# EAGLE design Board (EAGLE 7.3.0)
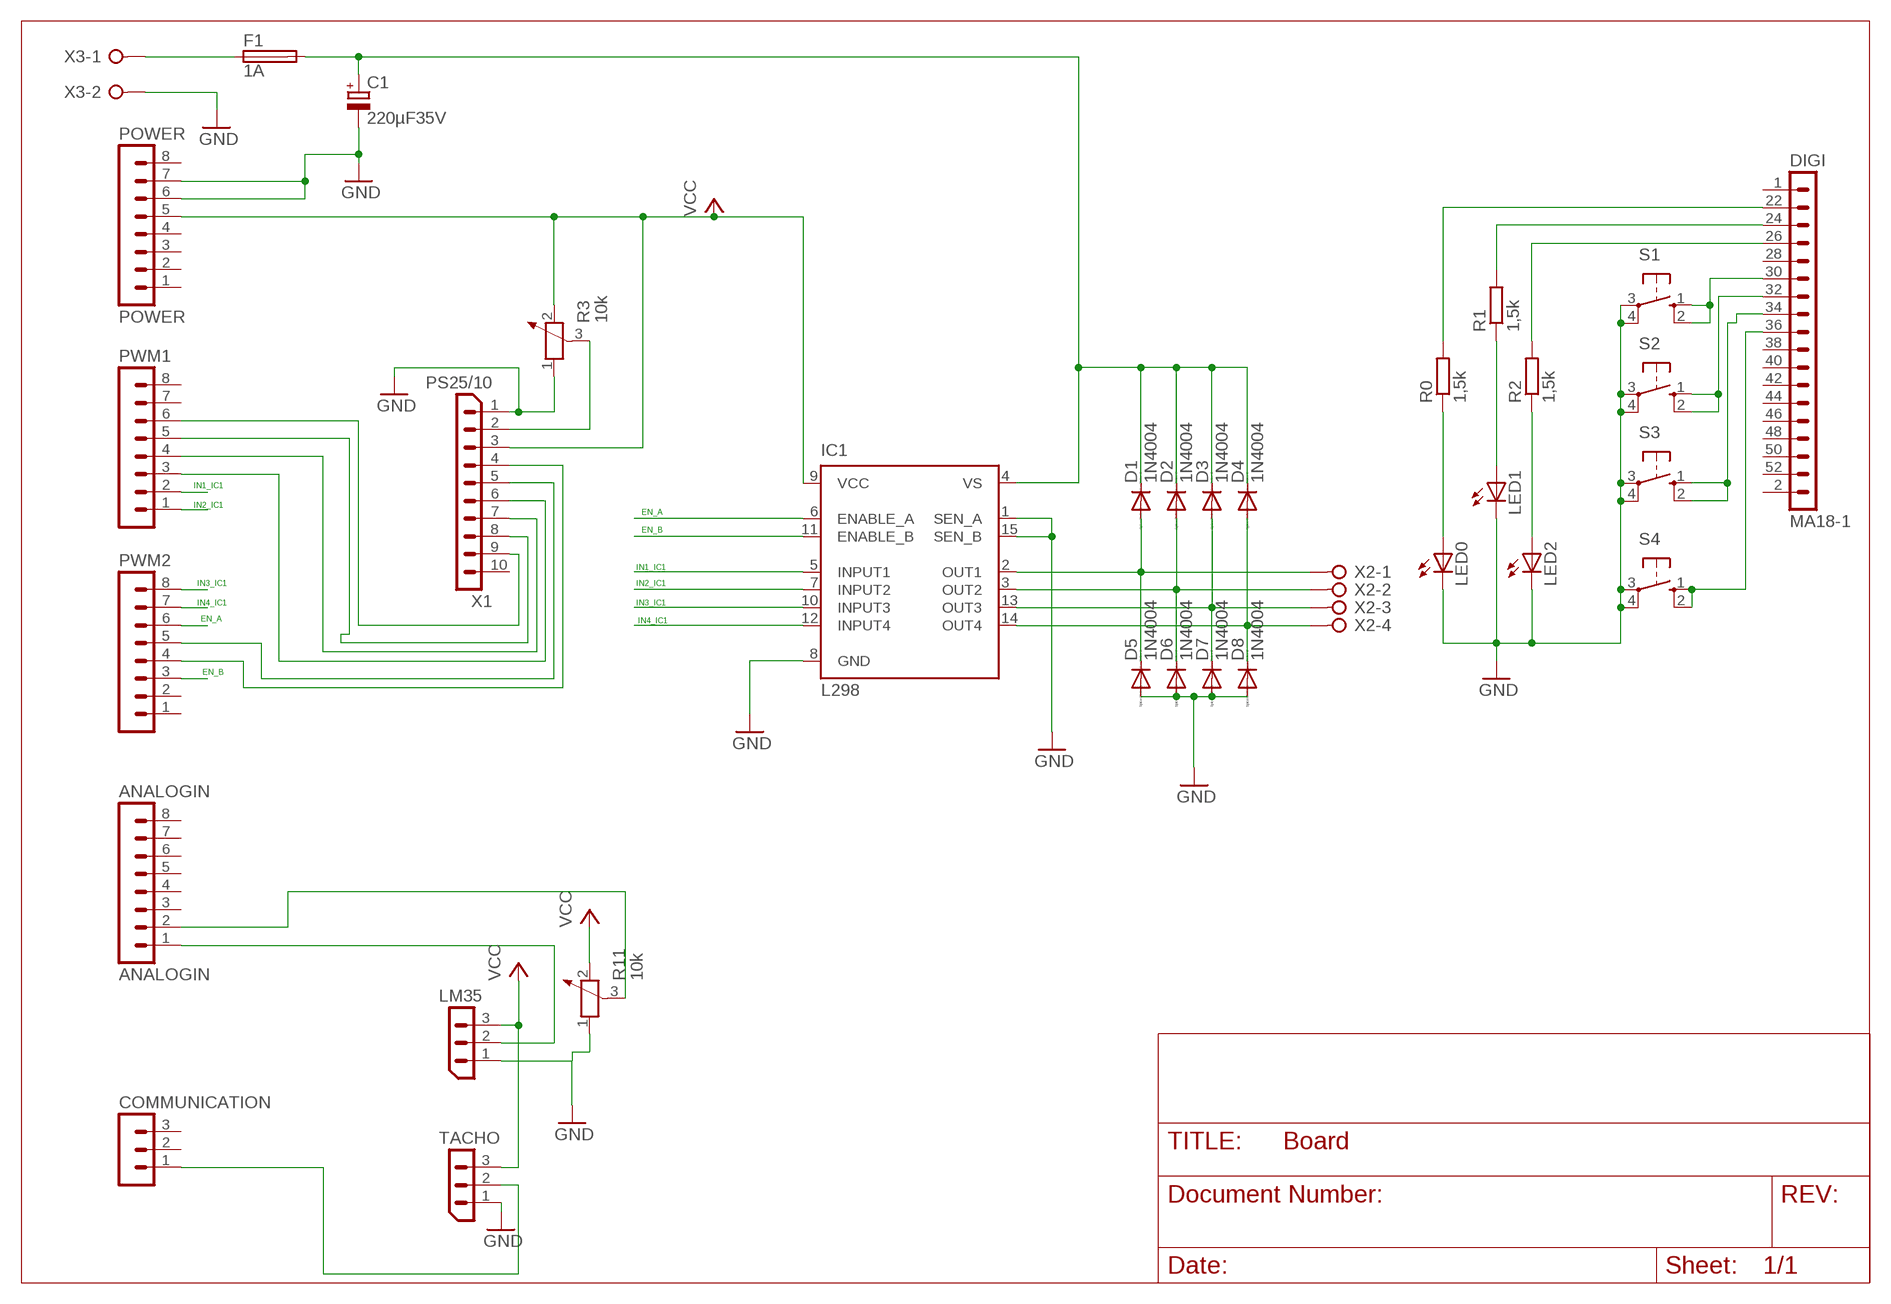
[diagram p0: schematic, sheet 1]

## Parts
ANALOGIN  ANALOGIN  MA08-1  [MA08-1]
C1  220µF35V  CPOL-EUE5-10.5  [E5-10,5]
COMMUNICATION  MA03-1  [MA03-1]
D1  1N4004  [DO41-10]
D2  1N4004  [DO41-10]
D3  1N4004  [DO41-10]
D4  1N4004  [DO41-10]
D5  1N4004  [DO41-10]
D6  1N4004  [DO41-10]
D7  1N4004  [DO41-10]
D8  1N4004  [DO41-10]
DIGI  MA18-1  [MA18-1]
F1  1A  19560  [19560]
IC1  L298  [MULTIWATT-15]
LED0  LED3MM  [LED3MM]
LED1  LED3MM  [LED3MM]
LED2  LED3MM  [LED3MM]
LM35  PS25/10  [PS25/10]
POWER  POWER  MA08-1  [MA08-1]
PWM1  MA08-1  [MA08-1]
PWM2  MA08-1  [MA08-1]
R0  1,5k  R-EU_0207/10  [0207/10]
R1  1,5k  R-EU_0207/10  [0207/10]
R2  1,5k  R-EU_0207/10  [0207/10]
R3  10k  POTENTIOMETER_PT-10  [PT-10]
R11  10k  POTENTIOMETER_PT-10  [PT-10]
S1  10-XX  [B3F-10XX]
S2  10-XX  [B3F-10XX]
S3  10-XX  [B3F-10XX]
S4  10-XX  [B3F-10XX]
TACHO  PS25/10  [PS25/10]
X1  PS25/10  [PS25/10]
X2  W237-04P  [W237-4P]
X3  W237-02P  [W237-132]

## Nets
EN_A: IC1.6(ENABLE_A) PWM2.6
EN_B: IC1.11(ENABLE_B) PWM2.3
GND: C1.- D5.A D6.A D7.A D8.A IC1.1(SEN_A) IC1.8(GND) IC1.15(SEN_B) LED0.K(C) LED1.K(C) LED2.K(C) LM35.1 POWER.6 POWER.7 R3.1 R11.1 S1.3(P) S1.4(P1) S2.3(P) S2.4(P1) S3.3(P) S3.4(P1) S4.3(P) S4.4(P1) TACHO.1 X1.1 X3.2
IN1_IC1: IC1.5(INPUT1) PWM1.2
IN2_IC1: IC1.7(INPUT2) PWM1.1
IN3_IC1: IC1.10(INPUT3) PWM2.8
IN4_IC1: IC1.12(INPUT4) PWM2.7
N$1: COMMUNICATION.1 TACHO.2
N$2: PWM1.6 X1.9
N$3: ANALOGIN.2 R11.3
N$4: PWM1.5 X1.8
N$5: PWM1.4 X1.7
N$6: PWM1.3 X1.6
N$7: PWM2.5 X1.5
N$8: PWM2.4 X1.4
N$9: R3.3 X1.2
N$11: F1.1 X3.1
N$12: C1.+ D1.C D2.C D3.C D4.C F1.2 IC1.4(VS)
N$13: LED0.A R0.1
N$14: DIGI.24 R1.2
N$15: LED1.A R1.1
N$16: D4.A D8.C IC1.14(OUT4) X2.4
N$17: DIGI.22 R0.2
N$18: LED2.A R2.1
N$19: DIGI.26 R2.2
N$20: DIGI.36 S4.1(S) S4.2(S1)
N$21: DIGI.34 S3.1(S) S3.2(S1)
N$22: DIGI.32 S2.1(S) S2.2(S1)
N$23: DIGI.30 S1.1(S) S1.2(S1)
N$24: D1.A D5.C IC1.2(OUT1) X2.1
N$25: D2.A D6.C IC1.3(OUT2) X2.2
N$26: D3.A D7.C IC1.13(OUT3) X2.3
RASTER: ANALOGIN.1 LM35.2
VCC: IC1.9(VCC) LM35.3 POWER.5 R3.2 R11.2 TACHO.3 X1.3
Unconnected: ANALOGIN.3 ANALOGIN.4 ANALOGIN.5 ANALOGIN.6 ANALOGIN.7 ANALOGIN.8 COMMUNICATION.2 COMMUNICATION.3 DIGI.1 DIGI.2 DIGI.28 DIGI.38 DIGI.40 DIGI.42 DIGI.44 DIGI.46 DIGI.48 DIGI.50 DIGI.52 POWER.1 POWER.2 POWER.3 POWER.4 POWER.8 PWM1.7 PWM1.8 PWM2.1 PWM2.2 X1.10

## Notes on the sheet
- IN1_IC1
- IN2_IC1
- EN_A
- EN_B
- IN1_IC1
- IN3_IC1 | IN2_IC1
- IN4_IC1 | IN3_IC1
- EN_A | IN4_IC1
- EN_B

## Library data of the parts
ANALOGIN POWER PWM1 PWM2 = con-lstb:MA08-1: PIN HEADER; OC_FARNELL: unknown; OC_NEWARK: unknown
C1 = rcl:CPOL-EU: POLARIZED CAPACITOR, European symbol
COMMUNICATION = con-lstb:MA03-1: PIN HEADER; OC_FARNELL: unknown; OC_NEWARK: unknown
D1-D8 = diode:1N4004: DIODE general purpose rectifier, 1 A
DIGI = MA18_1:MA18-1
F1 = fuse:19560: FUSE HOLDER TR5, Wickmann; MPN: 56000001009; OC_FARNELL: 1185363; OC_NEWARK: 15P8392
IC1 = st-microelectronics:L298: DUAL FULL-BRIDGE DRIVER; MPN: L298N; OC_FARNELL: 1589425; OC_NEWARK: 32M1527
LED0 LED1 LED2 = led:LED: LED OSRAM: - CHIPLED LG R971, LG N971, LY N971, LG Q971, LY Q971, LO R971, LY R971 LH N974, LH R974 LS Q976, LO Q976, LY Q976 LO Q996 - Hyper CHIPLED LW Q18S LB Q993, LB Q99A, LB R99A - SideLED LS A670, LO A670, LY A670, LG A670, LP A670 LB A673, LV A673, LT A673, LW A673 LH A674 LY A675 LS A676, LA A676, LO A676, LY A676, LW A676 LS A679, LY A679, LG A679 - Hyper Micro SIDELED® LS Y876, LA Y876, LO Y876, LY Y876 LT Y87S - SmartLED LW L88C, LW L88S LB L89C, LB L89S, LG L890 LS L89K, LO L89K, LY L89K LS L896, LA L896, LO L896, LY L896 - TOPLED LS T670, LO T670, LY T670, LG T670, LP T670 LSG T670, LSP T670, LSY T670, LOP T670, LYG T670 LG T671, LOG T671, LSG T671 LB T673, LV T673, LT T673, LW T673 LH T674 LS T676, LA T676, LO T676, LY T676, LB T676, LH T676, LSB T676, LW T676 LB T67C, LV T67C, LT T67C, LS T67K, LO T67K, LY T67K, LW E67C LS E67B, LA E67B, LO E67B, LY E67B, LB E67C, LV E67C, LT E67C LW T67C LS T679, LY T679, LG T679 LS T770, LO T770, LY T770, LG T770, LP T770 LB T773, LV T773, LT T773, LW T773 LH T774 LS E675, LA E675, LY E675, LS T675 LS T776, LA T776, LO T776, LY T776, LB T776 LHGB T686 LT T68C, LB T68C - Hyper Mini TOPLED® LB M676 - Mini TOPLED Santana® LG M470 LS M47K, LO M47K, LY M47K Source: http://www.osram.convergy.de LUXEON: - LUMILED® LXK2-PW12-R00, LXK2-PW12-S00, LXK2-PW14-U00, LXK2-PW14-V00 LXK2-PM12-R00, LXK2-PM12-S00, LXK2-PM14-U00 LXK2-PE12-Q00, LXK2-PE12-R00, LXK2-PE12-S00, LXK2-PE14-T00, LXK2-PE14-U00 LXK2-PB12-K00, LXK2-PB12-L00, LXK2-PB12-M00, LXK2-PB14-N00, LXK2-PB14-P00, LXK2-PB14-Q00 LXK2-PR12-L00, LXK2-PR12-M00, LXK2-PR14-Q00, LXK2-PR14-R00 LXK2-PD12-Q00, LXK2-PD12-R00, LXK2-PD12-S00 LXK2-PH12-R00, LXK2-PH12-S00 LXK2-PL12-P00, LXK2-PL12-Q00, LXK2-PL12-R00 Source: www.luxeon.com KINGBRIGHT: KA-3528ASYC Source: www.kingbright.com
LM35 TACHO = Platinenstecker_3pol:PS25/10
R0 R1 R2 = rcl:R-EU_: RESISTOR, European symbol
R3 R11 = rcl:POTENTIOMETER_: Potentiometer
S1-S4 = switch-omron:10-XX: OMRON SWITCH; MPN: B3F-1000; OC_FARNELL: 176432; OC_NEWARK: 36M3542
X1 = Platinenstecker_10pol:PS25/10
X2 = con-wago-508:W237-04P: WAGO SREW CLAMP; OC_FARNELL: unknown; OC_NEWARK: unknown
X3 = con-wago-508:W237-02P: WAGO SREW CLAMP; OC_FARNELL: unknown; OC_NEWARK: unknown

## Board
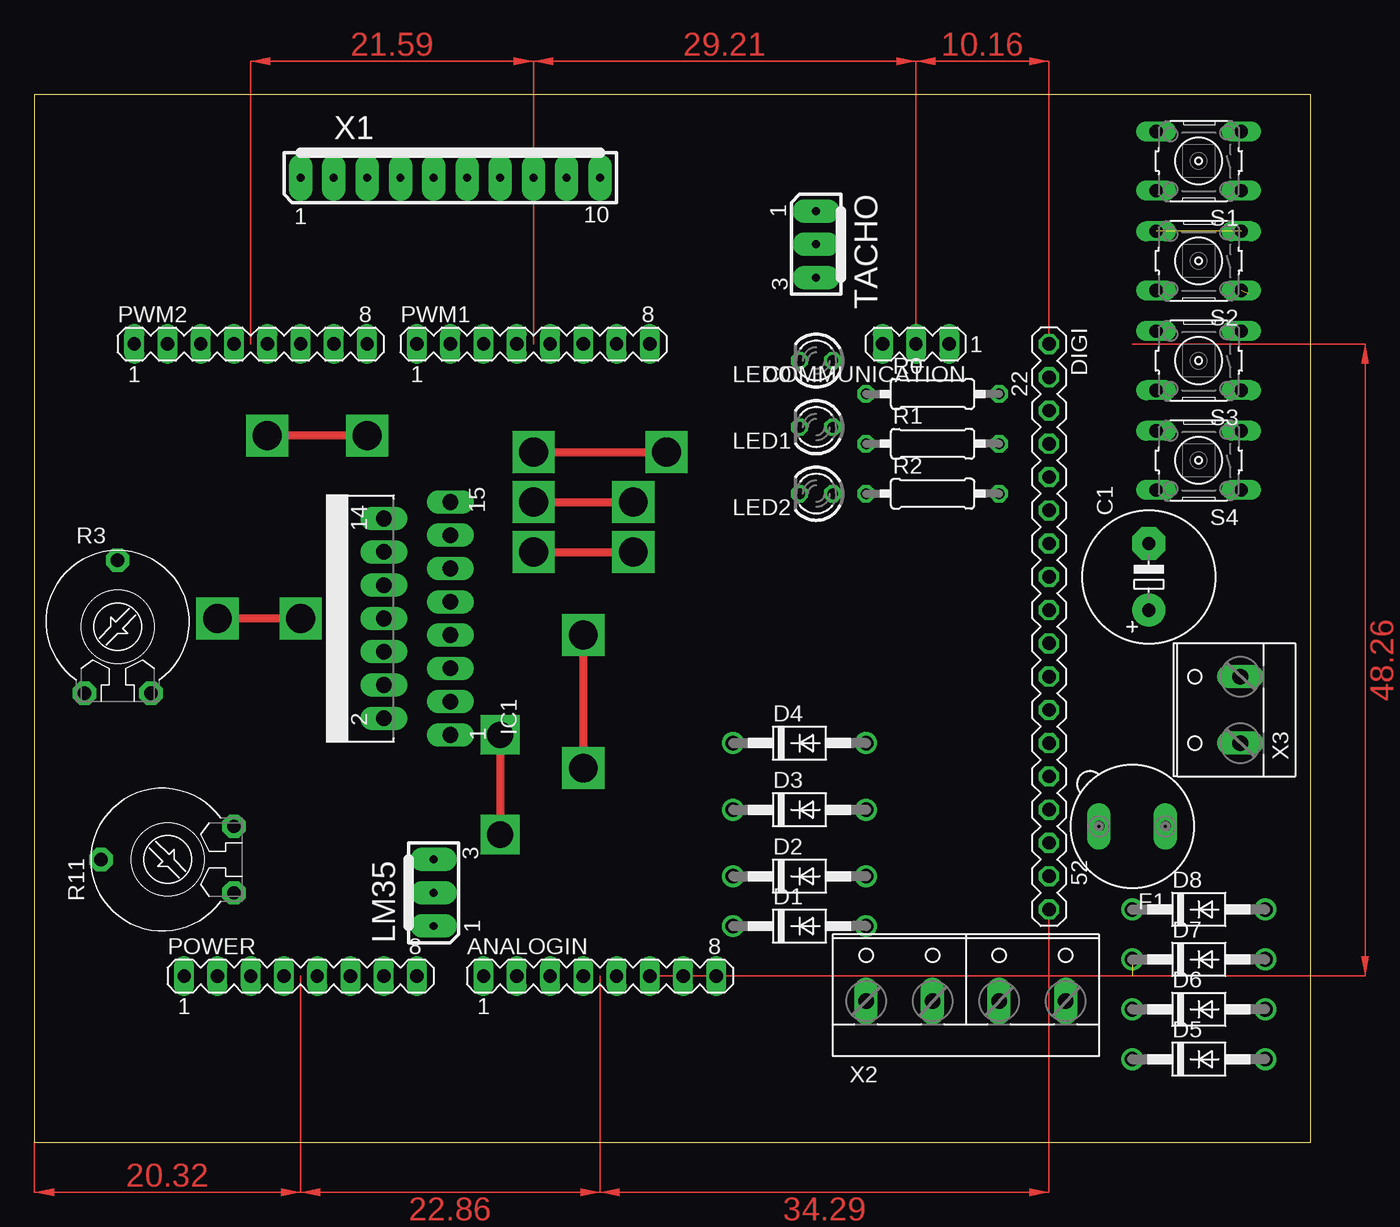
[diagram p1: board, top side]
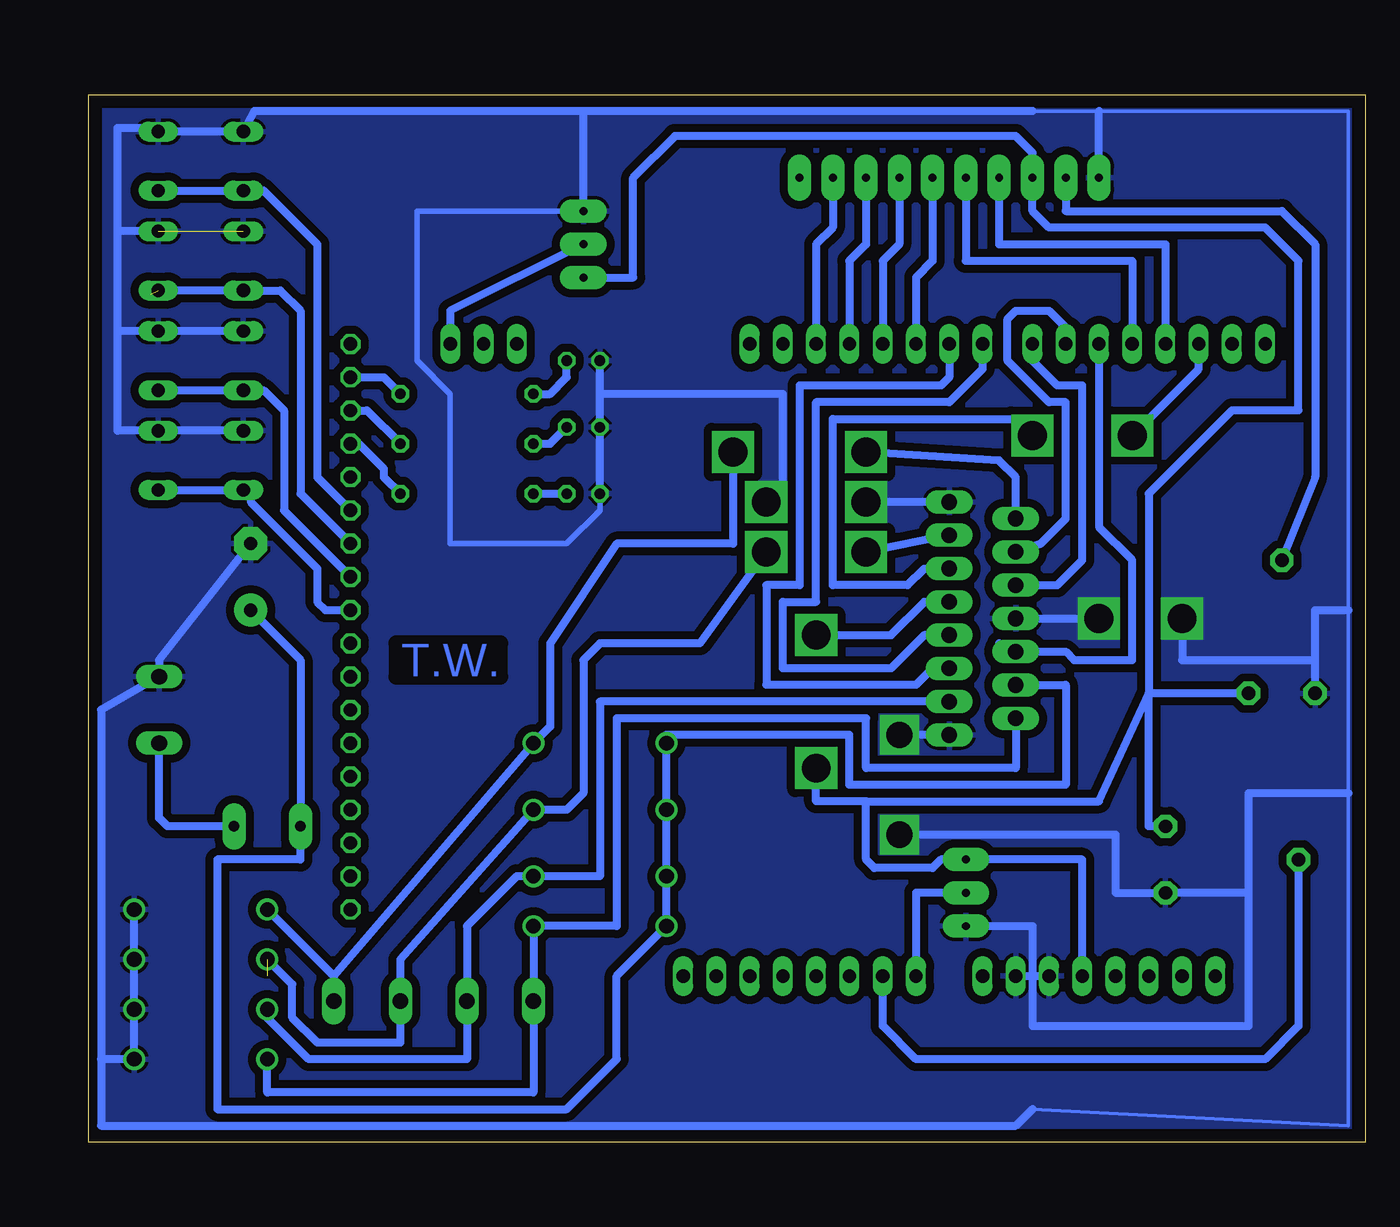
[diagram p2: board, bottom side, seen from below]

Size 97.46 x 80 mm. Coordinates in mm from the lower left corner, seen from the top.
Outline: 0,0 97.46,0 97.46,80 0,80 0,0
Copper layers (1*16): Top 0.035mm / dielectric 1.5mm / Bottom 0.035mm
Design rules "default *": minimum track width 10mil, minimum drill 24mil, track to track 8mil, track to pad 8mil, pad to pad 8mil, via to via 8mil, smd to smd 8mil, copper to edge 40mil, drill to drill 8mil, minimum pad ring 10mil, minimum via ring 8mil, stop-mask expansion 4mil, vias tented up to drill 0mil, thermal gap 10mil

### Footprints (pad centres in the part's own frame; a part is rotated, then mirrored left to right if it is on the bottom)
MA08-1 = drill 1.016 long: 1 -8.89,0; 2 -6.35,0; 3 -3.81,0; 4 -1.27,0; 5 1.27,0; 6 3.81,0; 7 6.35,0; 8 8.89,0
E5-10,5 = drill 1.016 pad 2.54: + -2.54,0 | drill 1.016 pad 2.54 octagon: - 2.54,0
MA03-1 = drill 1.016 long: 1 -2.54,0; 2 0,0; 3 2.54,0
DO41-10 = drill 1.118: A 5.08,0; C -5.08,0
MA18-1 = drill 1.016 octagon: 1 -21.59,0; 2 21.59,0; 22 -19.05,0; 24 -16.51,0; 26 -13.97,0; 28 -11.43,0; 30 -8.89,0; 32 -6.35,0; 34 -3.81,0; 36 -1.27,0; 38 1.27,0; 40 3.81,0; 42 6.35,0; 44 8.89,0; 46 11.43,0; 48 13.97,0; 50 16.51,0; 52 19.05,0
19560 = drill 0.813 pad 1.778 long: 1 -2.54,0; 2 2.54,0
MULTIWATT-15 = drill 1.2 long: 1 -8.89,-7.62; 2 -7.62,-2.54; 3 -6.35,-7.62; 4 -5.08,-2.54; 5 -3.81,-7.62; 6 -2.54,-2.54; 7 -1.27,-7.62; 8 0,-2.54; 9 1.27,-7.62; 10 2.54,-2.54; 11 3.81,-7.62; 12 5.08,-2.54; 13 6.35,-7.62; 14 7.62,-2.54; 15 8.89,-7.62
LED3MM = drill 0.813 octagon: A -1.27,0; K 1.27,0
PS25/10 = drill 0.61 pad 1.778 long: 1 -1.27,0; 2 1.27,0; 3 3.81,0
0207/10 = drill 0.813 octagon: 1 -5.08,0; 2 5.08,0
PT-10 = drill 1.016 pad 1.778 octagon: 1 -2.54,-5.08; 2 2.54,-5.08; 3 0,5.08
B3F-10XX = drill 1.016 long: 1 -3.251,2.261; 2 3.251,2.261; 3 -3.251,-2.261; 4 3.251,-2.261
PS25/10' = drill 0.61 pad 1.778 long: 1 -12.7,1.27; 2 -10.16,1.27; 3 -7.62,1.27; 4 -5.08,1.27; 5 -2.54,1.27; 6 0,1.27; 7 2.54,1.27; 8 5.08,1.27; 9 7.62,1.27; 10 10.16,1.27
W237-4P = drill 1.194 long: 1 -7.62,-0.635; 2 -2.54,-0.635; 3 2.54,-0.635; 4 7.62,-0.635
W237-132 = drill 1.194 long: 1 -2.54,-0.635; 2 2.54,-0.635

### Placement (x,y rotation side)
ANALOGIN  43.18,12.7 0 top
C1  85.09,43.18 90 top
COMMUNICATION  67.31,60.96 180 top
D1  58.42,16.51 0 top
D2  58.42,20.32 0 top
D3  58.42,25.4 0 top
D4  58.42,30.48 0 top
D5  88.9,6.35 0 top
D6  88.9,10.16 0 top
D7  88.9,13.97 0 top
D8  88.9,17.78 0 top
DIGI  77.47,39.37 270 top
F1  83.82,24.13 180 top
IC1  24.13,40.01 90 top
LED0  59.69,59.69 180 top
LED1  59.69,54.61 180 top
LED2  59.69,49.53 180 top
LM35  30.48,17.78 90 top
POWER  20.32,12.7 0 top
PWM1  38.1,60.96 0 top
PWM2  16.51,60.96 0 top
R0  68.58,57.15 0 top
R1  68.58,53.34 0 top
R2  68.58,49.53 0 top
R3  6.35,39.37 0 top
R11  10.16,21.59 90 top
S1  88.9,74.93 180 top
S2  88.9,67.31 180 top
S3  88.9,59.69 180 top
S4  88.9,52.07 180 top
TACHO  59.69,69.85 270 top
X1  PS25/10  [PS25/10']  33.02,72.39 0 top
X2  71.12,11.43 0 top
X3  91.44,33.02 90 top

### Tracks (layer width: path | path; a pad name or v marks a point on that pad's centre or on a via)
EN_A
  Bottom 0.61: PWM2.6 20.32,46.99 17.78,44.45 17.78,36.83 22.23,36.83 22.86,37.47 IC1.6 27.94,38.1
EN_B  (via drill 2.2 pad 0.61)
  Top 0.61: v25.4,53.98 v17.78,53.98
  Bottom 0.61: IC1.11 33.66,43.81 34.93,42.55 40.64,42.55 40.64,55.24 26.67,55.24 v25.4,53.98 | v17.78,53.98 12.7,59.05 PWM2.3
GND  (via drill 2 pad 0.61, 2.2 pad 0.61)  (1 unrouted)
  Top 0.61: v35.56,31.11 v35.56,23.5 | v38.1,48.9 v45.72,48.9 | v20.32,40.01 v13.97,40.01
  Bottom 0.254: 26.67,78.74 20.32,78.74 1.27,78.74 1.27,40.64 1.27,26.67 1.27,1.27 25.4,2.54
  Bottom 0.406: TACHO.1 72.39,71.12 72.39,59.69 69.85,57.15 69.85,45.72 60.96,45.72 58.42,48.26 LED2.K
  Bottom 0.61: 25.4,78.74 26.67,78.74 59.69,78.74 | 59.69,78.74 84.81,78.74 S1.4 S1.3 92.15,77.47 95.25,77.47 95.25,69.57 | POWER.7 25.4,12.7 | 25.4,12.7 POWER.6 | TACHO.1 59.69,78.74 | D8.A D7.A D6.A D5.A 96.52,6.35 | 96.52,6.35 96.52,33.02 X3.2 92.07,36.83 C1.- | 96.52,6.35 96.52,1.27 26.67,1.27 25.4,2.54 | S2.3 95.25,69.57 | S3.4 S3.3 95.25,61.95 | 95.25,61.95 95.25,69.57 | S4.4 S4.3 | S4.3 92.71,54.33 92.71,54.61 92.15,54.61 S4.3 | S4.3 95.25,54.33 95.25,61.95 | LED2.K LED1.K 58.42,57.15 | 58.42,57.15 LED0.K | 1.27,40.64 3.81,40.64 3.81,36.83 | R3.1 3.81,36.83 | IC1.1 v35.56,31.11 | LM35.1 25.4,16.51 25.4,12.7 | 25.4,12.7 25.4,8.89 8.89,8.89 8.89,19.05 | 8.89,19.05 R11.1 19.05,19.05 19.05,23.5 v35.56,23.5 | 8.89,19.05 8.89,26.67 1.27,26.67 | IC1.15 v38.1,48.9 | v45.72,48.9 44.45,49.53 44.45,57.15 58.42,57.15 | IC1.8 v20.32,40.01 | v13.97,40.01 13.97,36.83 3.81,36.83 | X1.1 20.32,78.74
  pour Bottom (isolate 0.61): 0,80.01 97.79,80.01 97.79,0 0,0
IN1_IC1
  Bottom 0.61: PWM1.2 31.75,58.42 32.38,57.78 43.18,57.78 43.18,42.55 45.72,42.55 45.72,34.92 34.29,34.92 33.02,36.2 IC1.5
IN2_IC1
  Bottom 0.61: PWM1.1 29.21,59.05 31.75,56.52 41.91,56.52 41.91,41.27 44.45,41.27 44.45,36.2 36.2,36.2 33.66,38.73 IC1.7
IN3_IC1
  Bottom 0.61: PWM2.8 25.4,59.69 23.5,57.78 21.59,57.78 21.59,44.45 23.5,42.55 IC1.10
IN4_IC1
  Bottom 0.61: IC1.12 24.77,45.72 22.86,47.62 22.86,56.52 24.13,56.52 27.3,59.69 27.3,62.87 26.67,63.5 24.13,63.5 22.86,62.23 PWM2.7
N$1
  Bottom 0.61: TACHO.2 69.85,63.5 COMMUNICATION.1
N$2
  Bottom 0.61: X1.9 40.64,69.85 41.91,68.58 PWM1.6
N$3
  Bottom 0.61: R11.3 5.08,8.89 7.62,6.35 34.29,6.35 36.83,8.89 36.83,10.16 36.83,11.43 ANALOGIN.2
N$4
  Bottom 0.61: X1.8 38.1,68.58 39.37,67.31 PWM1.5
N$5
  Bottom 0.61: X1.7 35.56,68.58 36.83,67.31 PWM1.4
N$6
  Bottom 0.61: X1.6 33.02,67.31 34.29,66.04 PWM1.3
N$7
  Bottom 0.61: X1.5 30.48,67.31 17.78,67.31 PWM2.5
N$8
  Bottom 0.61: X1.4 27.94,68.58 15.24,68.58 PWM2.4
N$9
  Bottom 0.61: X1.2 22.86,71.12 6.35,71.12 3.81,68.58 3.81,50.8 R3.3
N$11
  Bottom 0.61: F1.1 91.44,24.13 92.07,24.77 X3.1
N$12
  Bottom 0.61: IC1.4 22.86,34.92 22.86,27.3 39.37,27.3 39.37,31.11 53.34,31.11 D4.C D3.C D2.C D1.C 57.15,12.7 57.15,6.35 60.96,2.54 87.63,2.54 87.63,21.59 81.28,21.59 F1.2 81.28,36.83 C1.+
N$13
  Bottom 0.61: R0.1 62.23,57.15 60.96,58.42 LED0.A
N$14
  Bottom 0.61: DIGI.24 76.2,55.88 R1.2
N$15
  Bottom 0.61: R1.1 62.23,53.34 LED1.A
N$16  (via drill 2.2 pad 0.61)
  Top 0.61: v38.1,52.7 v48.26,52.7
  Bottom 0.61: 78.74,12.7 D4.A 62.23,31.75 62.23,38.1 57.15,45.72 48.26,45.72 v48.26,52.7 | 78.74,12.7 X2.4 | D8.C 78.74,12.7 | IC1.14 26.67,50.8 27.94,52.07 v38.1,52.7
N$17
  Bottom 0.61: DIGI.22 74.93,58.42 R0.2
N$18
  Bottom 0.61: R2.1 LED2.A
N$19
  Bottom 0.61: DIGI.26 76.83,53.34 74.93,51.44 74.93,50.8 R2.2
N$20
  Bottom 0.61: S4.1 S4.2 | S4.2 85.09,49.81 85.09,49.53 | 85.09,49.53 85.65,49.53 S4.2 | 85.09,49.53 85.09,48.9 80.01,43.81 80.01,41.27 79.38,40.64 DIGI.36
N$21
  Bottom 0.61: S3.1 S3.2 84.1,57.43 82.55,55.88 82.55,48.26 DIGI.34
N$22  (1 unrouted)
  Bottom 0.61: 92.71,64.77 92.71,65.05 S2.2 82.83,65.05 81.28,63.5 81.28,49.53 DIGI.32
N$23
  Bottom 0.61: S1.1 S1.2 84.1,72.67 80.01,68.58 80.01,50.8 DIGI.30
N$24
  Bottom 0.61: D5.C 83.82,3.81 63.5,3.81 X2.1 D1.A 57.15,16.51 57.15,32.38 38.1,32.38 38.1,28.57 26.67,28.57 IC1.2
N$25
  Bottom 0.61: IC1.3 58.42,33.66 58.42,20.32 D2.A 64.77,20.32 68.58,16.51 X2.2 68.58,6.35 80.64,6.35 83.82,9.53 D6.C
N$26  (via drill 2.2 pad 0.61)  (1 unrouted)
  Top 0.61: v38.1,45.09 v45.72,45.09
  Bottom 0.61: IC1.13 v38.1,45.09 | v45.72,45.09 50.8,38.1 58.42,38.1 59.69,36.83 59.69,26.67 60.96,25.4 D3.A 73.66,13.97 X2.3 73.66,7.62 80.01,7.62 81.91,9.53 81.91,12.06 D7.C
RASTER
  Bottom 0.61: LM35.2 34.29,19.05 ANALOGIN.1
VCC  (via drill 2.2 pad 0.61)
  Top 0.61: v41.91,28.57 v41.91,38.73
  Bottom 0.61: TACHO.3 55.88,66.04 55.88,73.66 52.7,76.83 26.67,76.83 25.4,75.56 X1.3 25.4,71.12 24.13,69.85 7.62,69.85 5.08,67.31 5.08,55.88 10.16,55.88 16.51,49.53 16.51,34.29 | 38.1,26.04 20.32,26.04 16.51,34.29 | POWER.5 21.59,21.59 LM35.3 32.38,21.59 33.02,20.95 37.47,20.95 38.1,21.59 38.1,26.04 | v41.91,28.57 41.91,26.04 38.1,26.04 | v41.91,38.73 36.2,38.73 33.66,41.27 IC1.9 | R3.2 16.51,34.29 | R11.2 16.51,24.13 16.51,34.29
(copper drawn outside any net)
  shapes: Top area x7

### Text on the board
Bottom: T.W.